# Altium schematic sheet Main.SchDoc: Плата
size 594 x 420 mm; CompanyName: ООО "ЛАССАРД"; Address1: Address1; Address2: Address2; Address3: Address3; Address4: Address4; DocumentNumber: *Э3; SheetNumber: 1; SheetTotal: 10; Title2str: управления; DocumentType: Схема электрическая принципиальная
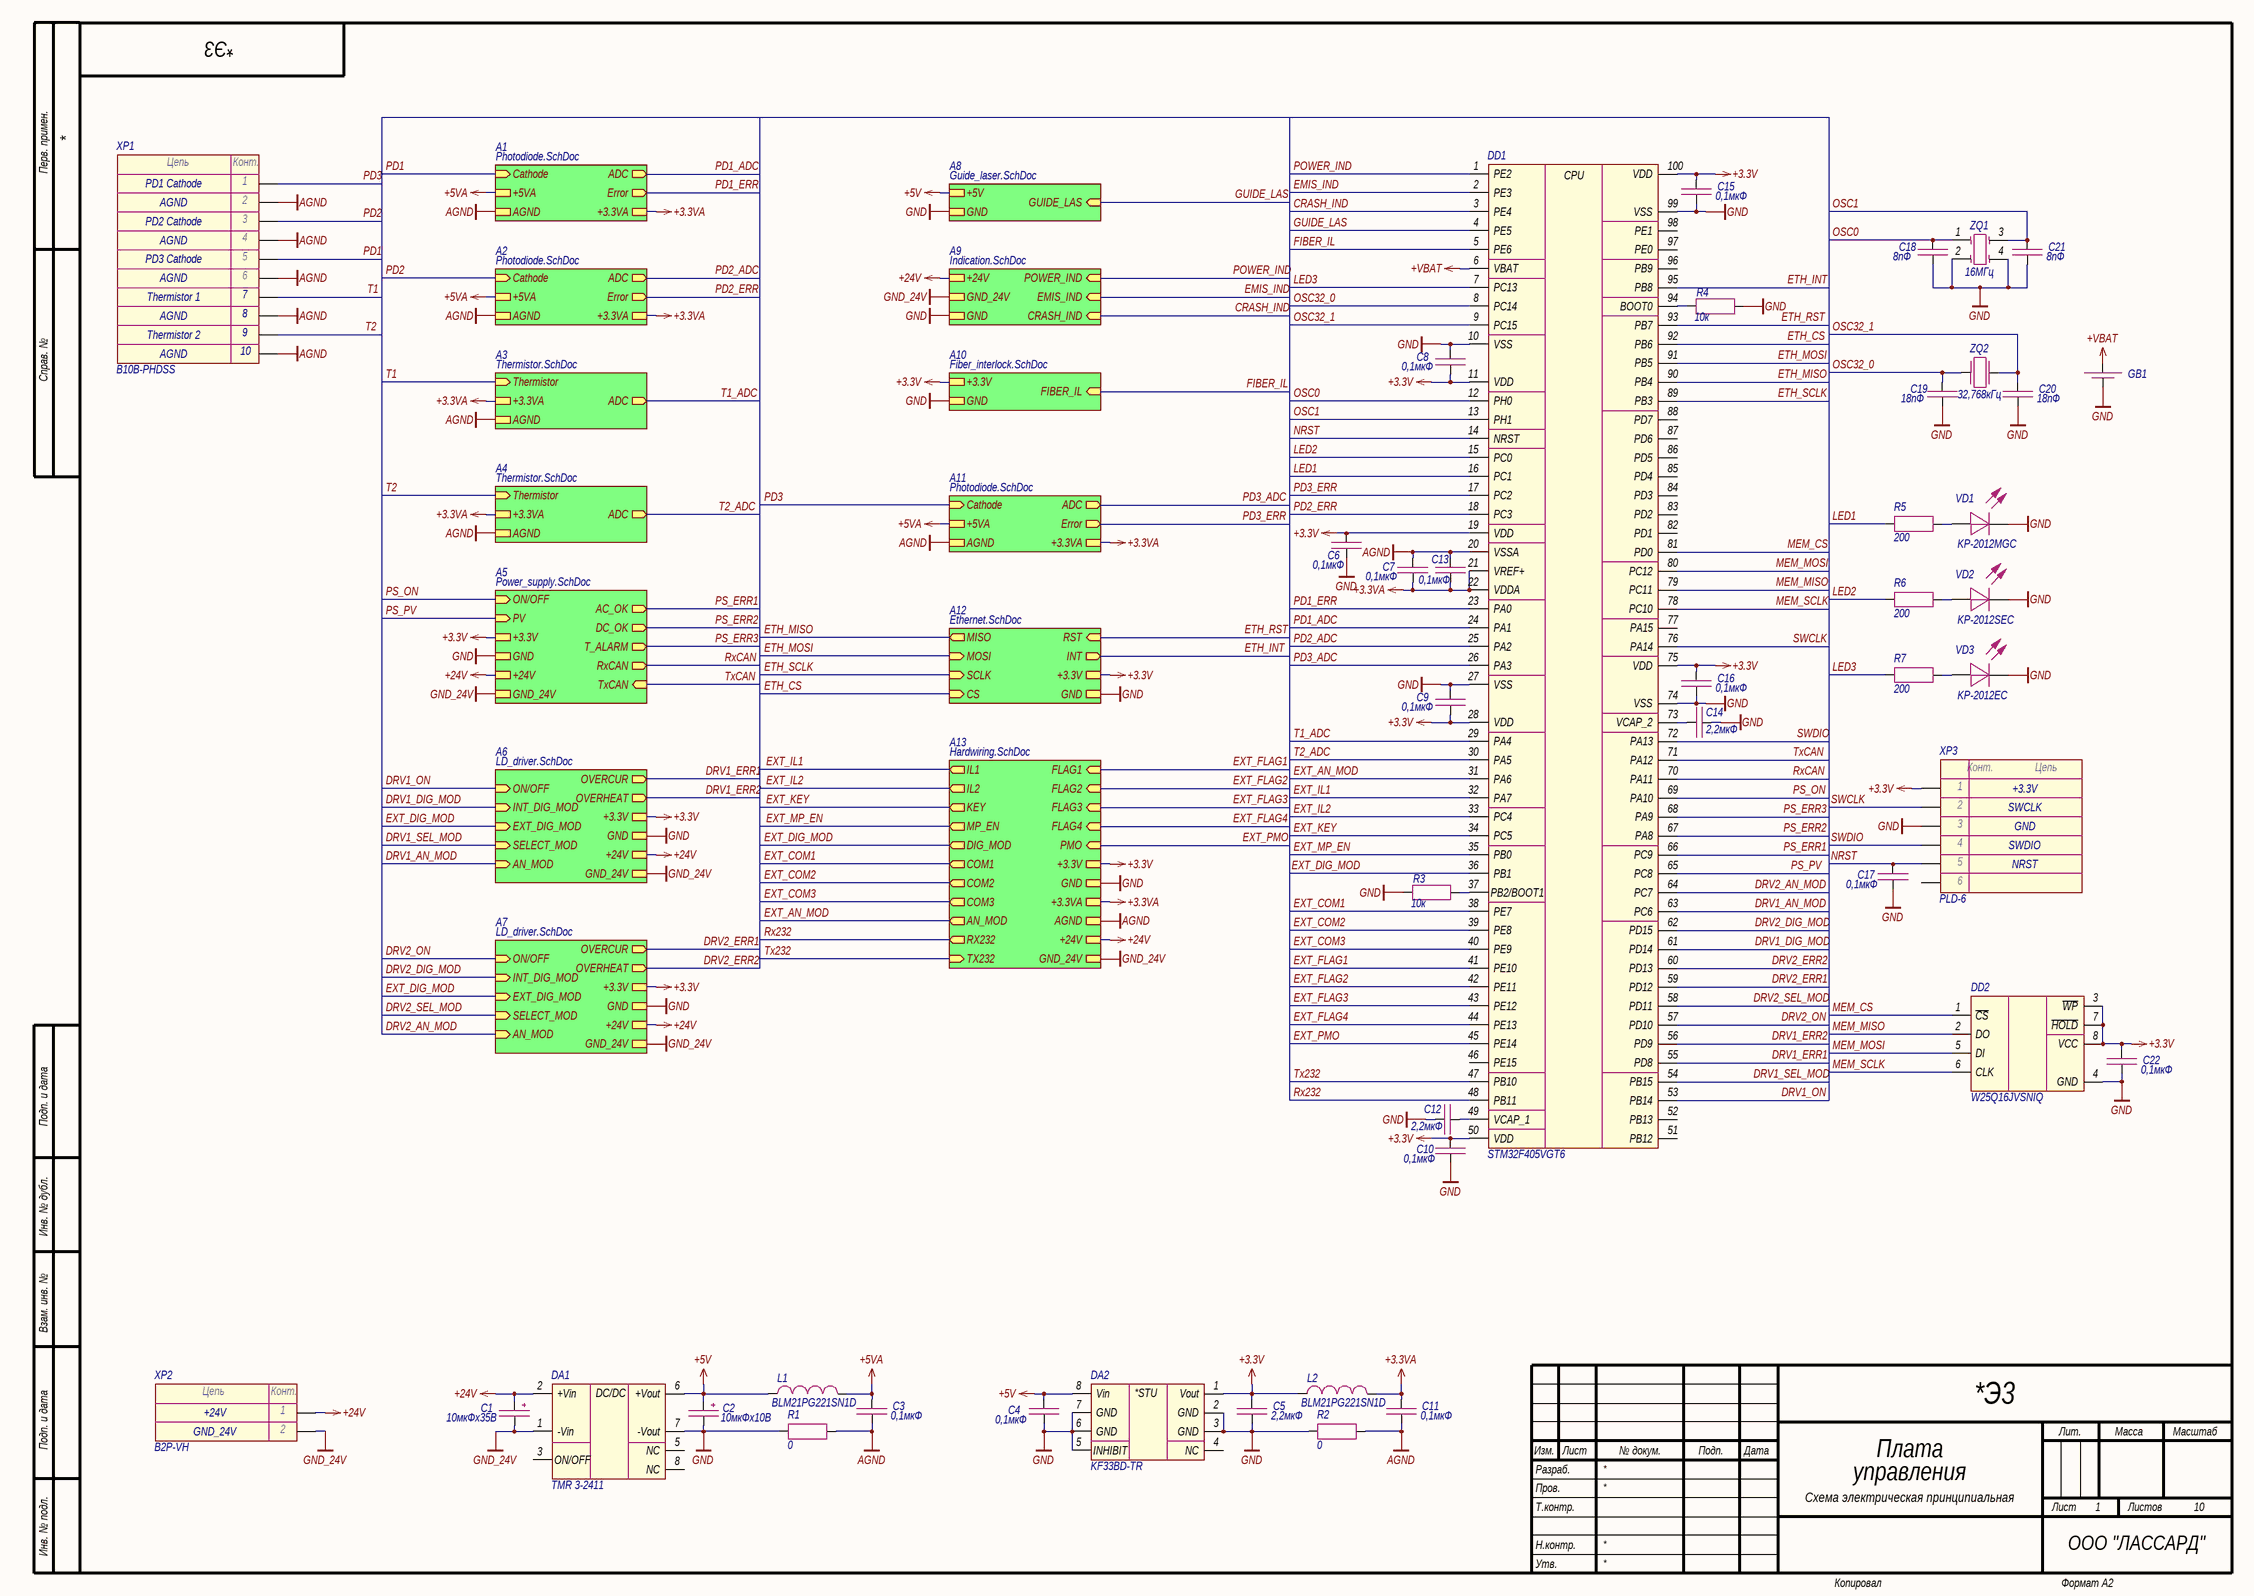
[diagram p0: Main.SchDoc]

## Parts
C1  10мкФх35B  [CAP_C]
C2  10мкФх10B  [CAP_A]
C3  0,1мкФ  [CAP_0603]
C4  0,1мкФ  [CAP_0603]
C5  2,2мкФ  [CAP_0603]
C6  0,1мкФ  [CAP_0603]
C7  0,1мкФ  [CAP_0603]
C8  0,1мкФ  [CAP_0603]
C9  0,1мкФ  [CAP_0603]
C10  0,1мкФ  [CAP_0603]
C11  0,1мкФ  [CAP_0603]
C12  2,2мкФ  [CAP_0603]
C13  0,1мкФ  [CAP_0603]
C14  2,2мкФ  [CAP_0603]
C15  0,1мкФ  [CAP_0603]
C16  0,1мкФ  [CAP_0603]
C17  0,1мкФ  [CAP_0603]
C18  8пФ  [CAP_0603]
C19  18пФ  [CAP_0603]
C20  18пФ  [CAP_0603]
C21  8пФ  [CAP_0603]
C22  0,1мкФ  [CAP_0603]
DA1  TMR 3-2411  [TMR3 (SIP-8)]
DA2  KF33BD-TR  [SOIC-8]
DD1  STM32F405VGT6  [LQFP-100]
DD2  W25Q16JVSNIQ  [SOIC-8]
GB1  DS1092-12-N8S  [DS1092-12-N8S]  (value not drawn)
L1  BLM21PG221SN1D  [IND_0805]
L2  BLM21PG221SN1D  [IND_0805]
R1  0  [RES_0805]
R2  0  [RES_0805]
R3  10к  [RES_0603]
R4  10к  [RES_0603]
R5  200  [RES_0603]
R6  200  [RES_0603]
R7  200  [RES_0603]
VD1  KP-2012MGC  [LED_0805]
VD2  KP-2012SEC  [LED_0805]
VD3  KP-2012EC  [LED_0805]
XP1  B10B-PHDSS  [B10B-PHDSS]
XP2  B2P-VH  [B2P-VH]
XP3  PLD-6  [PLD-6]
ZQ1  16МГц  [NX2520SA]
ZQ2  32,768кГц  [NX3215SA]

## Sub-sheets
A1 = Photodiode.SchDoc: Cathode (in), ADC (out), Error (out), AGND, +5VA, +3.3VA
A2 = Photodiode.SchDoc: Cathode (in), ADC (out), Error (out), AGND, +5VA, +3.3VA
A3 = Thermistor.SchDoc: Thermistor (in), +3.3VA, AGND, ADC (out)
A4 = Thermistor.SchDoc: Thermistor (in), +3.3VA, AGND, ADC (out)
A5 = Power_supply.SchDoc: ON/OFF (in), PV (in), +3.3V, GND, +24V, GND_24V, AC_OK (out), DC_OK (out), RxCAN (out), TxCAN (in), T_ALARM (out)
A6 = LD_driver.SchDoc: +3.3V, GND, OVERCUR (out), OVERHEAT (out), +24V, GND_24V, ON/OFF (in), INT_DIG_MOD (in), AN_MOD (in), EXT_DIG_MOD (in), SELECT_MOD (in)
A7 = LD_driver.SchDoc: +3.3V, GND, OVERCUR (out), OVERHEAT (out), +24V, GND_24V, ON/OFF (in), INT_DIG_MOD (in), AN_MOD (in), EXT_DIG_MOD (in), SELECT_MOD (in)
A8 = Guide_laser.SchDoc: GUIDE_LAS (in), +5V, GND
A9 = Indication.SchDoc: GND_24V, +24V, CRASH_IND (in), POWER_IND (in), EMIS_IND (in), GND
A10 = Fiber_interlock.SchDoc: FIBER_IL (in), +3.3V, GND
A11 = Photodiode.SchDoc: Cathode (in), ADC (out), Error (out), AGND, +5VA, +3.3VA
A12 = Ethernet.SchDoc: MISO (out), RST (in), MOSI (in), INT (out), SCLK (in), CS (in), +3.3V, GND
A13 = Hardwiring.SchDoc: IL1 (out), FLAG1 (in), RX232 (out), TX232 (in), IL2 (out), KEY (out), MP_EN (out), AN_MOD (out), FLAG2 (in), FLAG3 (in), FLAG4 (in), PMO (in), +3.3VA, AGND, +3.3V, GND, GND_24V, +24V, COM1 (out), COM2 (out), COM3 (out), DIG_MOD (out)

## Nets
+3.3V: C5.1 C6.1 C8.2 C9.2 C10.2 C15.1 C16.1 C22.1 DA2.1(Vout) DD1.11(VDD) DD1.19(VDD) DD1.28(VDD) DD1.50(VDD) DD1.75(VDD) DD1.100(VDD) DD2.3(~{WP}) DD2.7(~{HOLD}) DD2.8(VCC) L2.1 XP3.1 ; sheet A13/+3.3V, sheet A12/+3.3V, sheet A5/+3.3V, sheet A6/+3.3V, sheet A7/+3.3V, sheet A10/+3.3V
+3.3VA: C7.2 C11.1 C13.2 DD1.21(VREF+) DD1.22(VDDA) L2.2 ; sheet A13/+3.3VA, sheet A1/+3.3VA, sheet A3/+3.3VA, sheet A2/+3.3VA, sheet A4/+3.3VA, sheet A11/+3.3VA
+5V: C2.1 C4.1 DA1.6(+Vout) DA2.8(Vin) L1.1 ; sheet A8/+5V
+5VA: C3.1 L1.2 ; sheet A1/+5VA, sheet A2/+5VA, sheet A11/+5VA
+24V: C1.1 DA1.2(+Vin) XP2.1 ; sheet A9/+24V, sheet A13/+24V, sheet A5/+24V, sheet A6/+24V, sheet A7/+24V
+VBAT: DD1.6(VBAT) GB1.2
AGND: C3.2 C7.1 C11.2 C13.1 DD1.20(VSSA) R1.2 R2.2 XP1.2 XP1.4 XP1.6 XP1.8 XP1.10 ; sheet A13/AGND, sheet A1/AGND, sheet A3/AGND, sheet A2/AGND, sheet A4/AGND, sheet A11/AGND
GND: C2.2 C4.2 C5.2 C6.2 C8.1 C9.1 C10.1 C12.2 C14.2 C15.2 C16.2 C17.2 C18.2 C19.2 C20.2 C21.2 C22.2 DA1.7(-Vout) DA2.2(GND) DA2.3(GND) DA2.5(INHIBIT) DA2.6(GND) DA2.7(GND) DD1.10(VSS) DD1.27(VSS) DD1.74(VSS) DD1.99(VSS) DD2.4(GND) GB1.1 R1.1 R2.1 R3.2 R4.2 VD1.2(C) VD2.2(C) VD3.2(C) XP3.3 ZQ1.2 ZQ1.4 ; sheet A9/GND, sheet A13/GND, sheet A12/GND, sheet A5/GND, sheet A6/GND, sheet A8/GND, sheet A7/GND, sheet A10/GND
GND_24V: C1.2 DA1.1(-Vin) XP2.2 ; sheet A9/GND_24V, sheet A13/GND_24V, sheet A5/GND_24V, sheet A6/GND_24V, sheet A7/GND_24V
CRASH_IND: DD1.3(PE4) ; sheet A9/CRASH_IND
DRV1_AN_MOD: DD1.63(PC6) ; sheet A6/AN_MOD
DRV1_DIG_MOD: DD1.61(PD14) ; sheet A6/INT_DIG_MOD
DRV1_ERR1: DD1.55(PD8) ; sheet A6/OVERCUR
DRV1_ERR2: DD1.56(PD9) ; sheet A6/OVERHEAT
DRV1_ON: DD1.53(PB14) ; sheet A6/ON/OFF
DRV1_SEL_MOD: DD1.54(PB15) ; sheet A6/SELECT_MOD
DRV2_AN_MOD: DD1.64(PC7) ; sheet A7/AN_MOD
DRV2_DIG_MOD: DD1.62(PD15) ; sheet A7/INT_DIG_MOD
DRV2_ERR1: DD1.59(PD12) ; sheet A7/OVERCUR
DRV2_ERR2: DD1.60(PD13) ; sheet A7/OVERHEAT
DRV2_ON: DD1.57(PD10) ; sheet A7/ON/OFF
DRV2_SEL_MOD: DD1.58(PD11) ; sheet A7/SELECT_MOD
EMIS_IND: DD1.2(PE3) ; sheet A9/EMIS_IND
ETH_CS: DD1.92(PB6) ; sheet A12/CS
ETH_INT: DD1.95(PB8) ; sheet A12/INT
ETH_MISO: DD1.90(PB4) ; sheet A12/MISO
ETH_MOSI: DD1.91(PB5) ; sheet A12/MOSI
ETH_RST: DD1.93(PB7) ; sheet A12/RST
ETH_SCLK: DD1.89(PB3) ; sheet A12/SCLK
EXT_AN_MOD: DD1.31(PA6) ; sheet A13/AN_MOD
EXT_COM1: DD1.38(PE7) ; sheet A13/COM1
EXT_COM2: DD1.39(PE8) ; sheet A13/COM2
EXT_COM3: DD1.40(PE9) ; sheet A13/COM3
EXT_DIG_MOD: DD1.36(PB1) ; sheet A13/DIG_MOD, sheet A6/EXT_DIG_MOD, sheet A7/EXT_DIG_MOD
EXT_FLAG1: DD1.41(PE10) ; sheet A13/FLAG1
EXT_FLAG2: DD1.42(PE11) ; sheet A13/FLAG2
EXT_FLAG3: DD1.43(PE12) ; sheet A13/FLAG3
EXT_FLAG4: DD1.44(PE13) ; sheet A13/FLAG4
EXT_IL1: DD1.32(PA7) ; sheet A13/IL1
EXT_IL2: DD1.33(PC4) ; sheet A13/IL2
EXT_KEY: DD1.34(PC5) ; sheet A13/KEY
EXT_MP_EN: DD1.35(PB0) ; sheet A13/MP_EN
EXT_PMO: DD1.45(PE14) ; sheet A13/PMO
FIBER_IL: DD1.5(PE6) ; sheet A10/FIBER_IL
GUIDE_LAS: DD1.4(PE5) ; sheet A8/GUIDE_LAS
LED1: DD1.16(PC1) R5.1
LED2: DD1.15(PC0) R6.1
LED3: DD1.7(PC13) R7.1
MEM_CS: DD1.81(PD0) DD2.1(~{CS})
MEM_MISO: DD1.79(PC11) DD2.2(DO)
MEM_MOSI: DD1.80(PC12) DD2.5(DI)
MEM_SCLK: DD1.78(PC10) DD2.6(CLK)
NRST: C17.1 DD1.14(NRST) XP3.5
OSC0: C18.1 DD1.12(PH0) ZQ1.1
OSC1: C21.1 DD1.13(PH1) ZQ1.3
OSC32_0: C19.1 DD1.8(PC14) ZQ2.1
OSC32_1: C20.1 DD1.9(PC15) ZQ2.2
PD1: XP1.5 ; sheet A1/Cathode
PD1_ADC: DD1.24(PA1) ; sheet A1/ADC
PD1_ERR: DD1.23(PA0) ; sheet A1/Error
PD2: XP1.3 ; sheet A2/Cathode
PD2_ADC: DD1.25(PA2) ; sheet A2/ADC
PD2_ERR: DD1.18(PC3) ; sheet A2/Error
PD3: XP1.1 ; sheet A11/Cathode
PD3_ADC: DD1.26(PA3) ; sheet A11/ADC
PD3_ERR: DD1.17(PC2) ; sheet A11/Error
POWER_IND: DD1.1(PE2) ; sheet A9/POWER_IND
PS_ERR1: DD1.66(PC9) ; sheet A5/AC_OK
PS_ERR2: DD1.67(PA8) ; sheet A5/DC_OK
PS_ERR3: DD1.68(PA9) ; sheet A5/T_ALARM
PS_ON: DD1.69(PA10) ; sheet A5/ON/OFF
PS_PV: DD1.65(PC8) ; sheet A5/PV
Rx232: DD1.48(PB11) ; sheet A13/RX232
RxCAN: DD1.70(PA11) ; sheet A5/RxCAN
SWCLK: DD1.76(PA14) XP3.2
SWDIO: DD1.72(PA13) XP3.4
T1: XP1.7 ; sheet A3/Thermistor
T1_ADC: DD1.29(PA4) ; sheet A3/ADC
T2: XP1.9 ; sheet A4/Thermistor
T2_ADC: DD1.30(PA5) ; sheet A4/ADC
Tx232: DD1.47(PB10) ; sheet A13/TX232
TxCAN: DD1.71(PA12) ; sheet A5/TxCAN
NetC12_1: C12.1 DD1.49(VCAP_1)
NetC14_1: C14.1 DD1.73(VCAP_2)
NetDD1_37: DD1.37(PB2/BOOT1) R3.1
NetDD1_94: DD1.94(BOOT0) R4.1
NetR5_2: R5.2 VD1.1(A)
NetR6_2: R6.2 VD2.1(A)
NetR7_2: R7.2 VD3.1(A)

Not connected (* = marked no-connect by the designer): DA1 3(ON/OFF) 5(NC) 8(NC); DA2 4(NC); DD1 46(PE15) 51(PB12) 52(PB13) 77(PA15) 82(PD1) 83(PD2) 84(PD3) 85(PD4) 86(PD5) 87(PD6) 88(PD7) 96(PB9) 97(PE0) 98(PE1); XP3 6

## Notes on the sheet
- PD1 Cathode
- AGND
- PD2 Cathode
- PD3 Cathode
- Thermistor 1
- Thermistor 2
- +3.3V
- SWCLK
- GND
- SWDIO
- NRST
- +24V
- GND_24V
- Перв. примен.
- Справ. №
- Подп. и дата
- Инв. № дубл.
- Взам. инв. №
- Разраб.
- Изм.
- Лист
- № докум.
- Подп.
- Дата
- Лит.
- Масса
- Масштаб
- Пров.
- Т.контр.
- Листов
- Инв. № подл.
- Утв.
- Н.контр.
- Копировал
- Формат А2
- (in symbol Connector-2) Цепь; Конт.
- (in symbol Connector-6) Конт.; Цепь
- (in symbol Connector-10) Цепь; Конт.
- (in symbol KFXXBD-TR) *STU
- (in symbol STM32F405VG) CPU
- (in symbol TMR3) DC/DC

## Library data of the parts
C1 = Capacitor_Polar: Model: TECAP, 10 мкФ, 35 В, тип C, 10%; Value: 10мкФх35B; Document: *; Manufacturer: *
C2 = Capacitor_Polar: Model: TECAP, 10 мкФ, 10 В, тип A, 10%; Value: 10мкФх10B; Document: *; Manufacturer: *
C3 C4 C6-C11 C13 C15-C17 C22 = Capacitor: Manufacturer: Murata; Model: GRM188R71H104KA93D; Value: 0,1мкФ; Document: *
C5 C12 C14 = Capacitor: Manufacturer: Murata; Model: GRM188R61H225KE11D; Value: 2,2мкФ; Document: *
C18 C21 = Capacitor: Manufacturer: Yageo; Model: CC0603CRNPO9BN8R0; Value: 8пФ; Document: *
C19 C20 = Capacitor: Manufacturer: Murata; Model: GRM1885C1H180FA01D; Value: 18пФ; Document: *
DA1 = TMR3: Manufacturer: Traco Power; Model: TMR 3-2411; Document: *
DA2 = KFXXBD-TR: Manufacturer: STMicroelectronics; Model: KF33BD-TR; Document: *
DD1 = STM32F405VG: Manufacturer: STMicroelectronics; Model: STM32F405VGT6; Document: *
DD2 = W25Q: Manufacturer: Winbond; Model: W25Q16JVSNIQ; Document: *
GB1 = Accumulator: Manufacturer: Connfly; Model: DS1092-12-N8S; Document: *
L1 L2 = Inductor: Manufacturer: Murata; Value: *; Model: BLM21PG221SN1D; Document: *
R1 R2 = Resistor: Manufacturer: Yageo; Model: RC0805FR-070RL; Value: 0; Document: *
R3 R4 = Resistor: Manufacturer: Yageo; Model: RC0603FR-0710KL; Value: 10к; Document: *
R5-R7 = Resistor: Manufacturer: Yageo; Model: RC0603FR-07200RL; Value: 200; Document: *
VD1-VD3 = LED: Manufacturer: Kingbright; Document: *
  VD1: Model: KP-2012MGC
  VD2: Model: KP-2012SEC
  VD3: Model: KP-2012EC
XP1 = Connector-10: Manufacturer: JST; Model: B10B-PHDSS; Document: *
XP2 = Connector-2: Manufacturer: JST; Model: B2P-VH; Document: *
XP3 = Connector-6: Manufacturer: Connfly; Model: PLD-6; Document: *
ZQ1 = Quartz_Resonator_4-pin: Manufacturer: NDK; Model: NX2520SA-16MHZ-STD-CSW-5; Value: 16МГц; Document: *
ZQ2 = Quartz_Resonator: Manufacturer: NDK; Model: NX3215SA- 32.768K-STD-MUA-8; Value: 32,768кГц; Document: *